# EAGLE schematic DorMouse-V0.5 (EAGLE 6.3)
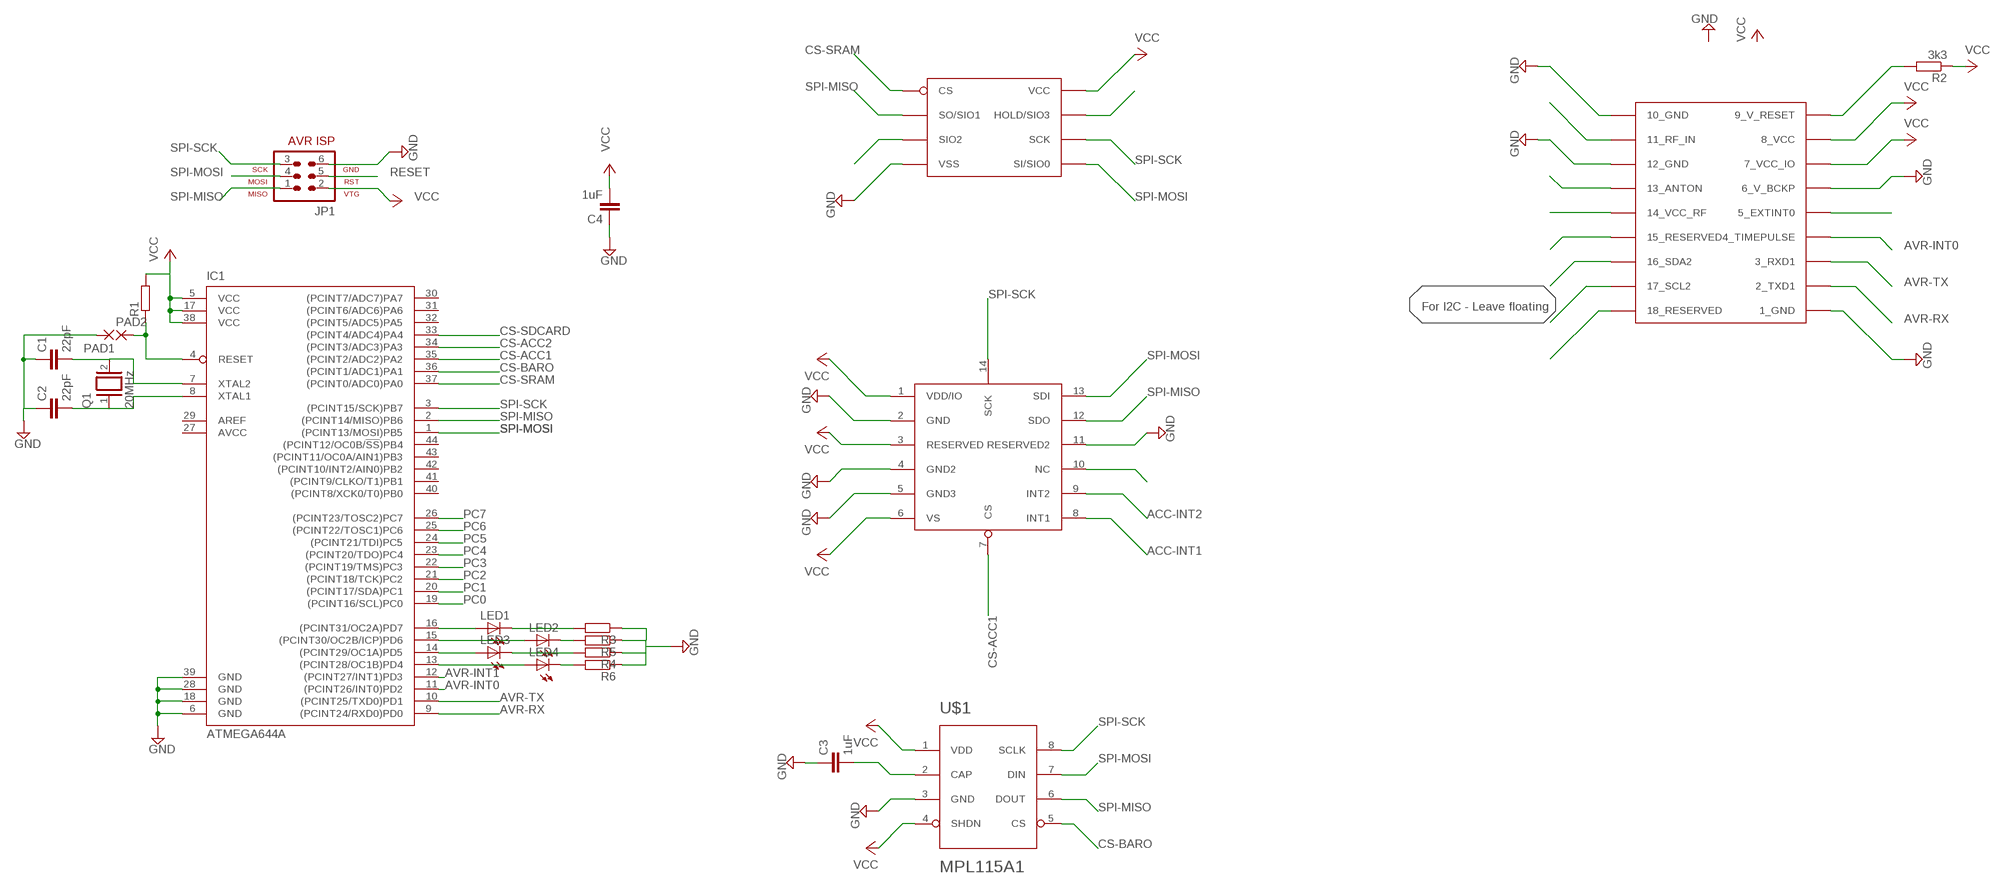
[diagram p0: schematic, sheet 1]

## Parts
C1  22pF  C-EUC0402  [C0402]
C2  22pF  C-EUC0402  [C0402]
C3  1uF  C-EUC0402  [C0402]
C4  1uF  C-EUC0402  [C0402]
IC1  ATMEGA644A  [TQFP44]
JP1  AVR-ISP-6  [AVR-ISP-6]
LED1  LEDCHIP-LED0603  [CHIP-LED0603]
LED2  LEDCHIP-LED0603  [CHIP-LED0603]
LED3  LEDCHIP-LED0603  [CHIP-LED0603]
LED4  LEDCHIP-LED0603  [CHIP-LED0603]
PAD1  SMD2  [SMD1,27-2,54]
PAD2  SMD2  [SMD1,27-2,54]
Q1  20MHz  XTAL/S  [QS]
R1  R-EU_R0402  [R0402]
R2  3k3  R-EU_R0402  [R0402]
R3  R-EU_R0402  [R0402]
R4  R-EU_R0402  [R0402]
R5  R-EU_R0402  [R0402]
R6  R-EU_R0402  [R0402]
SPI-SRAM  23LC1024  [SOIC8]
U$1  MPL115A1  [LGA-8]
U$2  ADXL345  [LGA-14]
U$3  UBLOX_MAX-6  [UBLOX_MAX-6]

## Nets
ACC-INT1: U$2.8(INT1)
ACC-INT2: U$2.9(INT2)
AVR-INT0: IC1.11((PCINT26/INT0)PD2) U$3.4_TIMEPULSE
AVR-INT1: IC1.12((PCINT27/INT1)PD3)
AVR-RX: IC1.9((PCINT24/RXD0)PD0) U$3.2_TXD1
AVR-TX: IC1.10((PCINT25/TXD0)PD1) U$3.3_RXD1
CS-ACC1: IC1.35((PCINT2/ADC2)PA2) U$2.7(CS)
CS-ACC2: IC1.34((PCINT3/ADC3)PA3)
CS-BARO: IC1.36((PCINT1/ADC1)PA1) U$1.5(CS)
CS-SDCARD: IC1.33((PCINT4/ADC4)PA4)
CS-SRAM: IC1.37((PCINT0/ADC0)PA0) SPI-SRAM.1(CS)
GND: C1.1 C2.1 C3.1 C4.1 IC1.6(GND) IC1.18(GND) IC1.28(GND) IC1.39(GND) JP1.6 PAD1.1(P) R3.1 R4.1 R5.1 R6.1 SPI-SRAM.4(VSS) U$1.3(GND) U$2.2(GND) U$2.4(GND2) U$2.5(GND3) U$2.11(RESERVED2) U$3.1_GND U$3.6_V_BCKP U$3.10_GND U$3.12_GND
N$1: C1.2 IC1.7(XTAL2) Q1.2
N$2: C2.2 IC1.8(XTAL1) Q1.1
N$3: C3.2 U$1.2(CAP)
N$4: U$3.5_EXTINT0
N$5: SPI-SRAM.3(SIO2)
N$7: IC1.16((PCINT31/OC2A)PD7) LED1.A
N$8: SPI-SRAM.7(HOLD/SIO3)
N$9: IC1.15((PCINT30/OC2B/ICP)PD6) LED2.A
N$11: U$2.10(NC)
N$12: IC1.14((PCINT29/OC1A)PD5) LED3.A
N$13: IC1.13((PCINT28/OC1B)PD4) LED4.A
N$14: LED1.C R3.2
N$15: R2.2 U$3.9_V_RESET
N$16: U$3.13_ANTON
N$17: LED2.C R5.2
N$18: U$3.11_RF_IN
N$19: LED3.C R4.2
N$20: U$3.15_RESERVED
N$21: U$3.16_SDA2
N$22: U$3.17_SCL2
N$23: U$3.18_RESERVED
N$24: U$3.14_VCC_RF
N$25: LED4.C R6.2
PC0: IC1.19((PCINT16/SCL)PC0)
PC1: IC1.20((PCINT17/SDA)PC1)
PC2: IC1.21((PCINT18/TCK)PC2)
PC3: IC1.22((PCINT19/TMS)PC3)
PC4: IC1.23((PCINT20/TDO)PC4)
PC5: IC1.24((PCINT21/TDI)PC5)
PC6: IC1.25((PCINT22/TOSC1)PC6)
PC7: IC1.26((PCINT23/TOSC2)PC7)
RESET: IC1.4(RESET) JP1.5 PAD2.1(P) R1.1
SPI-MISO: IC1.2((PCINT14/MISO)PB6) JP1.1 SPI-SRAM.2(SO/SIO1) U$1.6(DOUT) U$2.12(SDO)
SPI-MOSI: IC1.1((PCINT13/MOSI)PB5) JP1.4 SPI-SRAM.5(SI/SIO0) U$1.7(DIN) U$2.13(SDI)
SPI-SCK: IC1.3((PCINT15/SCK)PB7) JP1.3 SPI-SRAM.6(SCK) U$1.8(SCLK) U$2.14(SCK)
VCC: C4.2 IC1.5(VCC) IC1.17(VCC) IC1.38(VCC) JP1.2 R1.2 R2.1 SPI-SRAM.8(VCC) U$1.1(VDD) U$1.4(SHDN) U$2.1(VDD/IO) U$2.3(RESERVED) U$2.6(VS) U$3.7_VCC_IO U$3.8_VCC
Unconnected: IC1.29(AREF) IC1.30((PCINT7/ADC7)PA7) IC1.31((PCINT6/ADC6)PA6) IC1.32((PCINT5/ADC5)PA5) IC1.40((PCINT8/XCK0/T0)PB0) IC1.41((PCINT9/CLKO/T1)PB1) IC1.42((PCINT10/INT2/AIN0)PB2) IC1.43((PCINT11/OC0A/AIN1)PB3) IC1.44((PCINT12/OC0B/!SS!)PB4)

## Notes on the sheet
- For I2C - Leave floating

## Power pins joined to a net without a drawn wire
AVCC: IC1.27(AVCC)

## Library data of the parts
C1-C4 = rcl:C-EU: CAPACITOR, European symbol
IC1 = atmel:ATMEGA644: 8-bit Microcontroller with 64K Bytes In-System Programmable Flash Source: http://www.atmel.com/dyn/resources/prod_documents/doc2593.pdf; MPN: ATMEGA644PV-10AU; OC_FARNELL: 1455123; OC_NEWARK: 58M3748
JP1 = avr-5:AVR-ISP-6: AVR ISP-6 Serial Programming Header
LED1-LED4 = led:LED: LED OSRAM: - CHIPLED LG R971, LG N971, LY N971, LG Q971, LY Q971, LO R971, LY R971 LH N974, LH R974 LS Q976, LO Q976, LY Q976 LO Q996 - Hyper CHIPLED LW Q18S LB Q993, LB Q99A, LB R99A - SideLED LS A670, LO A670, LY A670, LG A670, LP A670 LB A673, LV A673, LT A673, LW A673 LH A674 LY A675 LS A676, LA A676, LO A676, LY A676, LW A676 LS A679, LY A679, LG A679 - Hyper Micro SIDELED® LS Y876, LA Y876, LO Y876, LY Y876 LT Y87S - SmartLED LW L88C, LW L88S LB L89C, LB L89S, LG L890 LS L89K, LO L89K, LY L89K LS L896, LA L896, LO L896, LY L896 - TOPLED LS T670, LO T670, LY T670, LG T670, LP T670 LSG T670, LSP T670, LSY T670, LOP T670, LYG T670 LG T671, LOG T671, LSG T671 LB T673, LV T673, LT T673, LW T673 LH T674 LS T676, LA T676, LO T676, LY T676, LB T676, LH T676, LSB T676, LW T676 LB T67C, LV T67C, LT T67C, LS T67K, LO T67K, LY T67K, LW E67C LS E67B, LA E67B, LO E67B, LY E67B, LB E67C, LV E67C, LT E67C LW T67C LS T679, LY T679, LG T679 LS T770, LO T770, LY T770, LG T770, LP T770 LB T773, LV T773, LT T773, LW T773 LH T774 LS E675, LA E675, LY E675, LS T675 LS T776, LA T776, LO T776, LY T776, LB T776 LHGB T686 LT T68C, LB T68C - Hyper Mini TOPLED® LB M676 - Mini TOPLED Santana® LG M470 LS M47K, LO M47K, LY M47K Source: http://www.osram.convergy.de LUXEON: - LUMILED® LXK2-PW12-R00, LXK2-PW12-S00, LXK2-PW14-U00, LXK2-PW14-V00 LXK2-PM12-R00, LXK2-PM12-S00, LXK2-PM14-U00 LXK2-PE12-Q00, LXK2-PE12-R00, LXK2-PE12-S00, LXK2-PE14-T00, LXK2-PE14-U00 LXK2-PB12-K00, LXK2-PB12-L00, LXK2-PB12-M00, LXK2-PB14-N00, LXK2-PB14-P00, LXK2-PB14-Q00 LXK2-PR12-L00, LXK2-PR12-M00, LXK2-PR14-Q00, LXK2-PR14-R00 LXK2-PD12-Q00, LXK2-PD12-R00, LXK2-PD12-S00 LXK2-PH12-R00, LXK2-PH12-S00 LXK2-PL12-P00, LXK2-PL12-Q00, LXK2-PL12-R00 Source: www.luxeon.com KINGBRIGHT: KA-3528ASYC Source: www.kingbright.com
PAD1 PAD2 = wirepad:SMD2: SMD PAD
Q1 = special:XTAL/S: CRYSTAL
R1-R6 = rcl:R-EU_: RESISTOR, European symbol
SPI-SRAM = Swallow:23LC1024
U$1 = Swallow:MPL115A1
U$2 = Swallow:ADXL345
U$3 = Swallow:UBLOX_MAX-6: UBLOX MAX-6